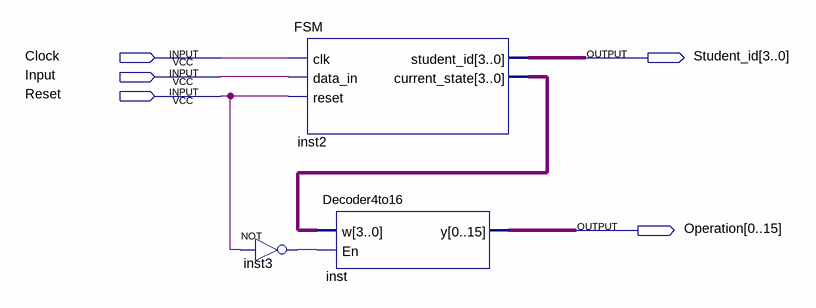
[diagram p0: schematic sheet]
// Quartus schematic ControlUnit.bdf as structural Verilog: 3 symbols, 5 pins
module ControlUnit (
  input  Clock,
  input  Input,
  input  Reset,
  output [3:0] Student_id,
  output [0:15] Operation
);

  wire inst3_out;
  wire [3:0] inst2_current_state;

  not inst3 (inst3_out, Reset);
  FSM inst2 (.clk(Clock), .data_in(Input), .reset(Reset), .student_id(Student_id), .current_state(inst2_current_state));
  Decoder4to16 inst (.w(inst2_current_state), .En(inst3_out), .y(Operation));
endmodule
